# Altium schematic sheet Arm Schematic.SchDoc
size A4
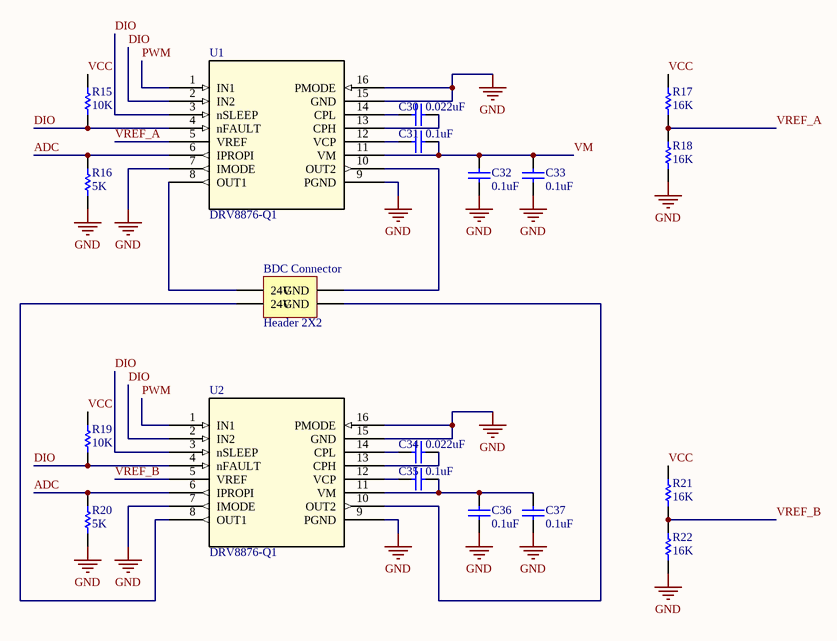
[diagram p0: Arm Schematic.SchDoc]

## Parts
BDC_Connector  Header 2X2  [MHDR2X2]
C30  0.022uF  [CAP_1206]
C31  0.1uF  [CAP_1206]
C32  0.1uF  [CAP_1206]
C33  0.1uF  [CAP_1206]
C34  0.022uF  [CAP_1206]
C35  0.1uF  [CAP_1206]
C36  0.1uF  [CAP_1206]
C37  0.1uF  [CAP_1206]
R15  10K  [AXIAL-0.3]
R16  5K  [AXIAL-0.3]
R17  16K  [AXIAL-0.3]
R18  16K  [AXIAL-0.3]
R19  10K  [AXIAL-0.3]
R20  5K  [AXIAL-0.3]
R21  16K  [AXIAL-0.3]
R22  16K  [AXIAL-0.3]
U1  DRV8876-Q1  [SOIC_PWPRQ1_TEX]
U2  DRV8876-Q1  [SOIC_PWPRQ1_TEX]

## Nets
GND: C32.1 C33.1 C36.1 C37.1 R16.1 R18.1 R20.1 R22.1 U1.7(IMODE) U1.9(PGND) U1.15(GND) U1.16(PMODE) U2.7(IMODE) U2.9(PGND) U2.15(GND) U2.16(PMODE)
ADC: R16.2 R20.2 U1.6(IPROPI) U2.6(IPROPI)
DIO: R15.1 R19.1 U1.2(IN2) U1.3(nSLEEP) U1.4(nFAULT) U2.2(IN2) U2.3(nSLEEP) U2.4(nFAULT)
PWM: U1.1(IN1) U2.1(IN1)
VCC: R15.2 R17.2 R19.2 R21.2
VM: C31.2 C32.2 C33.2 U1.11(VM)
VREF_A: R17.1 R18.2 U1.5(VREF)
VREF_B: R21.1 R22.2 U2.5(VREF)
NetBDC_Connector_1: BDC_Connector.1(24V) U1.8(OUT1)
NetBDC_Connector_2: BDC_Connector.2(GND) U1.10(OUT2)
NetBDC_Connector_3: BDC_Connector.3(24V) U2.8(OUT1)
NetBDC_Connector_4: BDC_Connector.4(GND) U2.10(OUT2)
NetC30_1: C30.1 U1.14(CPL)
NetC30_2: C30.2 U1.13(CPH)
NetC31_1: C31.1 U1.12(VCP)
NetC34_1: C34.1 U2.14(CPL)
NetC34_2: C34.2 U2.13(CPH)
NetC35_1: C35.1 U2.12(VCP)
NetC35_2: C35.2 C36.2 C37.2 U2.11(VM)

## Library data of the parts
BDC_Connector = MHDR2X2: Header, 2-Pin, Dual row; LatestRevisionDate: 17-Jul-2002; LatestRevisionNote: Re-released for DXP Platform.; Publisher: Altium Limited
C30-C37 = 22uF_16V_1208: Capacitor 1208 22uF; Manufacturer: Samsung Electro-Mechanics America, Inc; Manufacturer Part Number: CL31A226MOCLNNC; Capacitance: 0.022µF; Tolerance: ±20%; Voltage - Rated: 16V; Temperature Coefficient: X5R; Supplier 1: Digi-Key; RoHS: RoHS Compliant; Category: Capacitors; Stock 1: 99007; Pricing 1: 1=0.47, 10=0.395, 25=0.2716, 100=0.1975, 500=0.13084, 1000=0.11605 (CAD); Packaging: Cut Tape (CT); Mounting Type: Surface Mount, MLCC; Operating Temperature: -55°C ~ 85°C; Applications: General Purpose; Ratings: -; Package / Case: 1206 (3216 Metric); Size / Dimension: 0.126" L x 0.063" W (3.20mm x 1.60mm); Height - Seated (Max): -; Thickness (Max): 0.037" (0.95mm); Lead Spacing: -; Features: -; Lead Style: -; ComponentLink1URL: http://www.samsungsem.com/kr/front/downloadcms.do?path=/kr/support/product-search/mlcc/__icsFiles/afieldfile/2014/11/05&fileName=S_CL31A226MOCLNNC.pdf; ComponentLink1Description: http://www.samsungsem.com/kr/front/downloadcms.do?path=/kr/support/product-search/mlcc/__icsFiles/afieldfile/2014/11/05&fileName=S_CL31A226MOCLNNC.pdf; Supplier Part Number 1: 1276-2728-1-ND
R15-R22 = Res1: Resistor; Value: 1K; Published: 8-Jun-2000; LatestRevisionDate: 17-Jul-2002; LatestRevisionNote: Re-released for DXP Platform.; PackageReference: AXIAL-0.3; Publisher: Altium Limited; PackageDescription: Axial Device, Thru-Hole; 2 Leads; 0.3 in Pin Spacing
U1 U2 = DRV8876QPWPRQ1: No Description Available; Vendor: Texas Instruments; Built_By: EMA_Matt; SourceLibrary: TI_2020-07-01; Datasheet: https://www.ti.com/lit/ds/symlink/drv8876-q1.pdf?ts=1593552747152&ref_url=https%253A%252F%252Fwww.ti.com%252Fproduct%252FDRV8876-Q1; Manufacturer_Part_Number: DRV8876QPWPRQ1; Copyright: Copyright (C) 2018 Accelerated Designs. All rights reserved; RefDes: RefDes; Type: DEV